# Altium schematic sheet ProtectionChannelA.SchDoc
size 420 x 297 mm; Address1: Address1; Address2: Address2; Address3: Address3; Address4: Address4; DocumentNumber: АБВГ.123456.001 Э3; SheetNumber: 2; SheetTotal: 7; Scale: 1:1; DocumentType: Схема электрическая принципиальная; FirstReferrence: АБВГ.123456.001
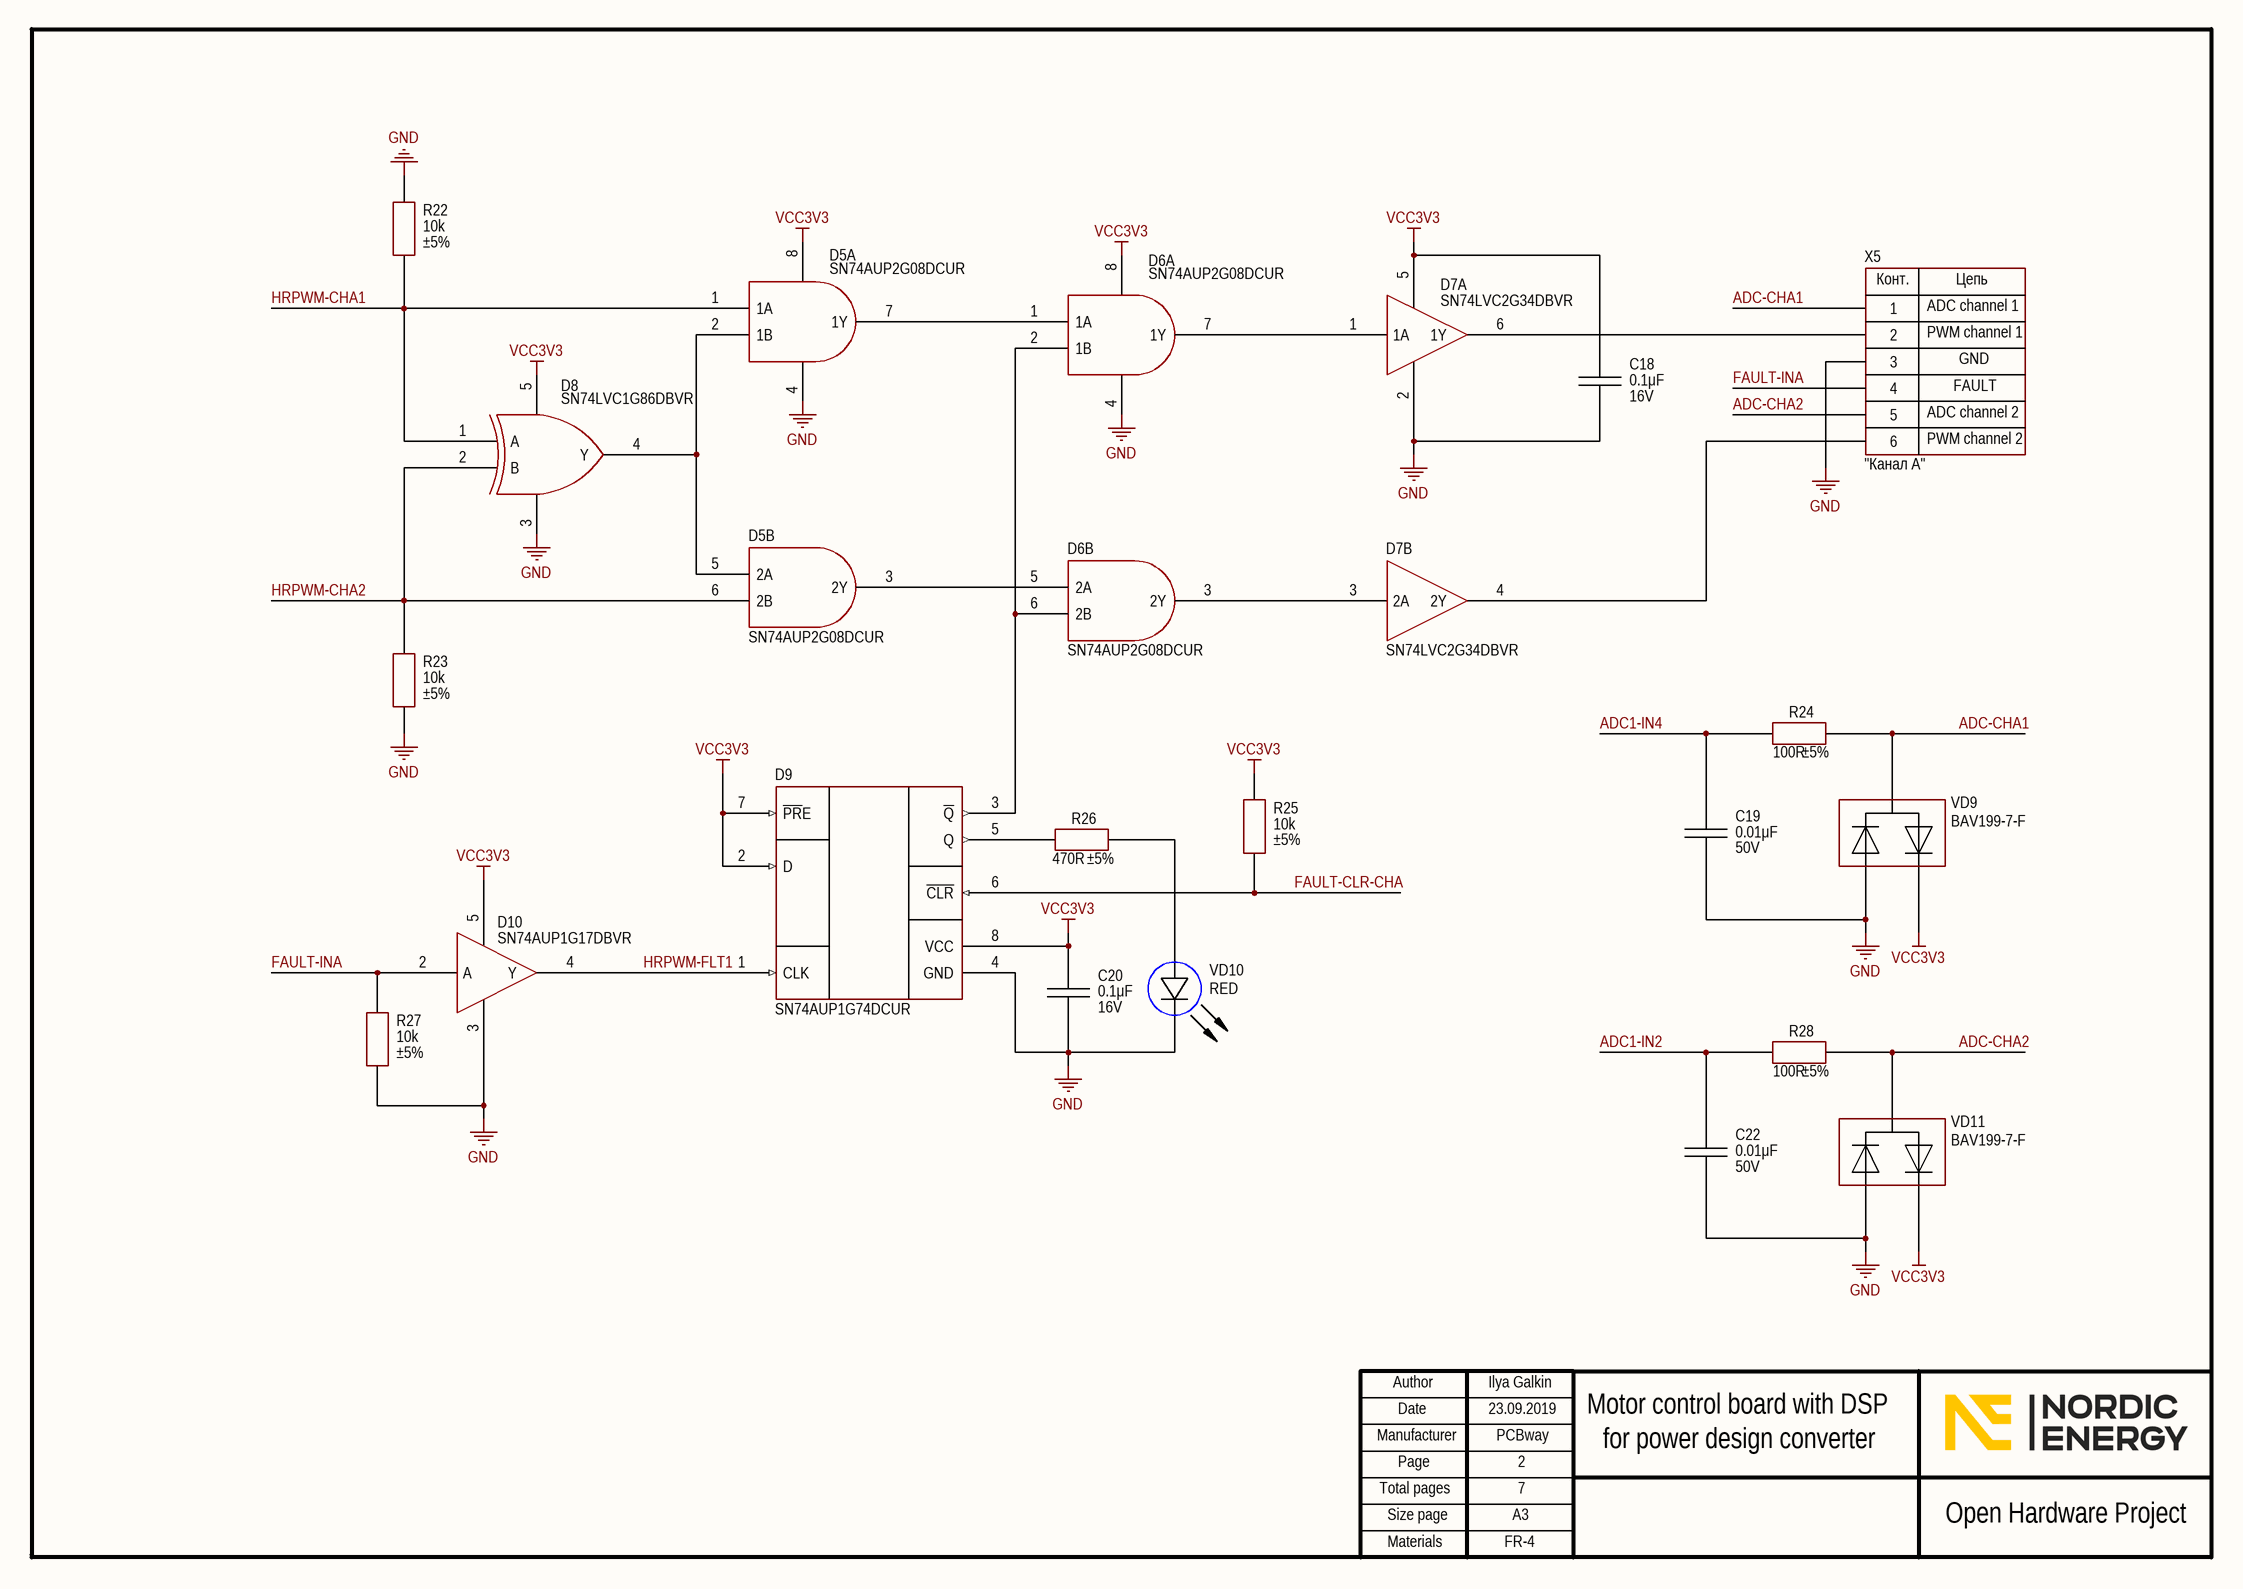
[diagram p0: ProtectionChannelA.SchDoc]

## Parts
C18  value 0.1μF  Voltage: 16V  [CAP: 0805]
C19  value 0.01μF  Voltage: 50V  [CAP: 0805]
C20  value 0.1μF  Voltage: 16V  [CAP: 0805]
C22  value 0.01μF  Voltage: 50V  [CAP: 0805]
D5  (no value)  [8-VSSOP]  (parts A,B of 2)
D6  (no value)  [8-VSSOP]  (parts A,B of 2)
D7  (no value)  [SOT23-6]  (parts A,B of 2)
D8  (no value)  [SOT23-5]
D9  (no value)  [8-VSSOP]
D10  (no value)  [SOT23-5]
R22  value 10k  Tolerance: ±5%  [RES: 0805]
R23  value 10k  Tolerance: ±5%  [RES: 0805]
R24  value 100R  Tolerance: ±5%  [RES: 0805]
R25  value 10k  Tolerance: ±5%  [RES: 0805]
R26  value 470R  Tolerance: ±5%  [RES: 0805]
R27  value 10k  Tolerance: ±5%  [RES: 0805]
R28  value 100R  Tolerance: ±5%  [RES: 0805]
VD9  PartNumber: BAV199-7-F  [SOT23]
VD10  Color: RED  [LED: 0805R]
VD11  PartNumber: BAV199-7-F  [SOT23]
X5  CommentText: "Канал А"  [CON: PLD-6]

## Nets
GND: C18.1 C19.1 C20.1 C22.1 D5.4 D6.4 D7.2 D8.3 D9.4(GND) D10.3 R22.1 R23.2 R27.2 VD9.1 VD10.2(C) VD11.1 X5.3
VCC3V3: C18.2 C20.2 D5.8 D6.8 D7.5 D8.5 D9.2(D) D9.7(~{PR}E) D9.8(VCC) D10.5 R25.1 VD9.2 VD11.2
ADC1-IN2: C22.2 R28.1
ADC1-IN4: C19.2 R24.1
ADC-CHA1: R24.2 VD9.3 X5.1
ADC-CHA2: R28.2 VD11.3 X5.5
FAULT-CLR-CHA: D9.6(~{CLR}) R25.2
FAULT-INA: D10.2(A) R27.1 X5.4
HRPWM-CHA1: D5.1(1A) D8.1(A) R22.2
HRPWM-CHA2: D5.6(2B) D8.2(B) R23.1
HRPWM-FLT1: D9.1(CLK) D10.4(Y)
NetD5_2: D5.2(1B) D5.5(2A) D8.4(Y)
NetD5_3: D5.3(2Y) D6.5(2A)
NetD5_7: D5.7(1Y) D6.1(1A)
NetD6_2: D6.2(1B) D6.6(2B) D9.3(~{Q})
NetD6_3: D6.3(2Y) D7.3(2A)
NetD6_7: D6.7(1Y) D7.1(1A)
NetD7_4: D7.4(2Y) X5.6
NetD7_6: D7.6(1Y) X5.2
NetD9_5: D9.5(Q) R26.2
NetR26_1: R26.1 VD10.1(A)

## Notes on the sheet
- ADC channel 1
- PWM channel 1
- FAULT
- GND
- ADC channel 2
- PWM channel 2
- Ilya Galkin
- 23.09.2019
- PCBway
- 2
- Motor control board with DSP
- for power design converter
- 7
- FR-4
- Author
- Manufacturer
- Date
- Page
- Total pages
- Size page
- A3
- Open Hardware Project
- Materials
- (in symbol PLD-6) Конт.; Цепь

## Library data of the parts
C18 C20 = Ceramic_0805: Manufacturer: Yageo; PartNumber: CC0805KRX7R7BB104; ValueManufacturerPartNumber: Ceramic capacitor, 0.1μF, X7R, ±10%, 16V, 0805, -55...+125°C; TypeCapacitor: Ceramic capacitor; Tolerance: ±10%; TypeDielectric: X7R; Package: 0805; HelpURL: https://www.digikey.com/product-detail/en/yageo/CC0805KRX7R7BB104/311-1142-1-ND/303052; Temperature: -55...+125°C
C19 C22 = Ceramic_0805: Manufacturer: Yageo; PartNumber: CC0805KRX7R9BB103; ValueManufacturerPartNumber: Ceramic capacitor, 0.01μF, X7R, ±10%, 50V, 0805, -55...+125°C; TypeCapacitor: Ceramic capacitor; Tolerance: ±10%; TypeDielectric: X7R; Package: 0805; HelpURL: https://www.digikey.com/product-detail/en/yageo/CC0805KRX7R9BB103/311-1136-1-ND/303046; Temperature: -55...+125°C
D5 D6 = SN74AUP2G08DCUR: AND; Manufacturer: Texas Instruments; ValueManufacturerPartNumber: IC logic AND, 0.8...3.6V, -40...+855°C, 8-VSSOP; Supply: 0.8...3.6V; HelpURL: https://www.digikey.com/product-detail/en/texas-instruments/SN74AUP2G08DCUR/296-32271-1-ND/3505517; Package: 8-VSSOP; ComponentType: IC logic AND; Temperature: -40...+855°C; PartNumber: SN74AUP2G08DCUR
D7 = SN74LVC2G34DBVR: Buffer; Manufacturer: Texas Instruments; ValueManufacturerPartNumber: IC logic buffer, 1.65...5.5V, -40...+125°C, SOT23-6; Supply: 1.65...5.5V; HelpURL: https://www.digikey.com/product-detail/en/texas-instruments/SN74LVC2G34DBVR/296-13496-1-ND/486431; Package: SOT23-6; ComponentType: IC logic buffer; Temperature: -40...+125°C; PartNumber: SN74LVC2G34DBVR
D8 = SN74LVC1G86DBVR: XOR; Manufacturer: Texas Instruments; ValueManufacturerPartNumber: IC logic XOR, 1.65...5.5V, -40...+125°C, SOT23-5; Supply: 1.65...5.5V; HelpURL: https://www.digikey.com/product-detail/en/texas-instruments/SN74LVC1G86DBVR/296-9853-1-ND/380077; Package: SOT23-5; ComponentType: IC logic XOR; Temperature: -40...+125°C; PartNumber: SN74LVC1G86DBVR
D9 = SN74AUP1G74DCUR: D-trigger; Manufacturer: Texas Instruments; ValueManufacturerPartNumber: ICtrigger D-type, 0.8...3.6V, -40...+85°C, 8-VSSOP; Supply: 0.8...3.6V; HelpURL: https://www.digikey.com/product-detail/en/texas-instruments/SN74AUP1G74DCUR/296-19761-1-ND/1091423; Package: 8-VSSOP; ComponentType: ICtrigger D-type; Temperature: -40...+85°C; PartNumber: SN74AUP1G74DCUR
D10 = SN74AUP1G17DBVR: Schmitt trigger; Manufacturer: Texas Instruments; ValueManufacturerPartNumber: IC Schmitt trigger, 0.8...3.6V, -40...+85°C, SOT23-6; Supply: 0.8...3.6V; HelpURL: https://www.digikey.com/product-detail/en/texas-instruments/SN74AUP1G17DBVR/296-19077-1-ND/864308; Package: SOT23-6; ComponentType: IC Schmitt trigger; Temperature: -40...+85°C; PartNumber: SN74AUP1G17DBVR
R22 R23 R25 R27 = Resistor_0805: Manufacturer: Yageo; PartNumber: RC0805JR-0710KL; ValueManufacturerPartNumber: Resistor film, 10k, ±5%, 0805, 0.125W, -55...+125°C; TypeResistor: Resistor film; Power: 0.125W; Package: 0805; HelpURL: https://www.digikey.com/product-detail/en/yageo/RC0805JR-0710KL/311-10KARCT-ND/731188; Temperature: -55...+125°C
R24 R28 = Resistor_0805: Manufacturer: Yageo; PartNumber: RC0805JR-07100RL; ValueManufacturerPartNumber: Resistor film, 100R, ±5%, 0805, 0.125W, -55...+125°C; TypeResistor: Resistor film; Power: 0.125W; Package: 0805; HelpURL: https://www.digikey.com/product-detail/en/yageo/RC0805JR-07100RL/311-100ARCT-ND/731185; Temperature: -55...+125°C
R26 = Resistor_0805: Manufacturer: Yageo; PartNumber: RC0805JR-07470RL; ValueManufacturerPartNumber: Resistor film, 470R, ±5%, 0805, 0.125W, -55...+125°C; TypeResistor: Resistor film; Power: 0.125W; Package: 0805; HelpURL: https://www.digikey.com/product-detail/en/yageo/RC0805JR-07470RL/311-470ARCT-ND/731280; Temperature: -55...+125°C
VD9 VD11 = Diode_array: Manufacturer: Diodes Incorporated; ValueManufacturerPartNumber: Diode array, 85V, 140mA, 1.1V, 3us, SOT-23, -65...+150°C; TypeDiode: Diode array; Voltage: 85V; Current: 140mA; VoltageDrop: 1.1V; RecoveryTime: 3us; Package: SOT-23; HelpURL: https://www.digikey.com/product-detail/en/diodes-incorporated/BAV199-7-F/BAV199-FDICT-ND/1033647; Temperature: -65...+150°C
VD10 = LED_single: Manufacturer: Wurth; ValueManufacturerPartNumber: LED, 20mA, 2V, 0805, -55...+150°C; PartNumber: 150080RS75000; TypeDiode: LED; Current: 20mA; VoltageDrop: 2V; Package: 0805; HelpURL: https://www.digikey.com/product-detail/en/wurth-electronics-inc/150080RS75000/732-4984-1-ND/4489916; Temperature: -55...+150°C
X5 = PLD-6: Manufacturer: Connfly; ValueManufacturerPartNumber: Connector, 6pin, 2.54mm, 500VAC, 3A; TypeConnector: Connector; VoltageMax: 500VAC; Pitch: 2.54mm; CurrentMax: 3A; Multichannel: 6pin; HelpURL: https://www.chipdip.ru/product/pld-6; PartNumber: PLD-6